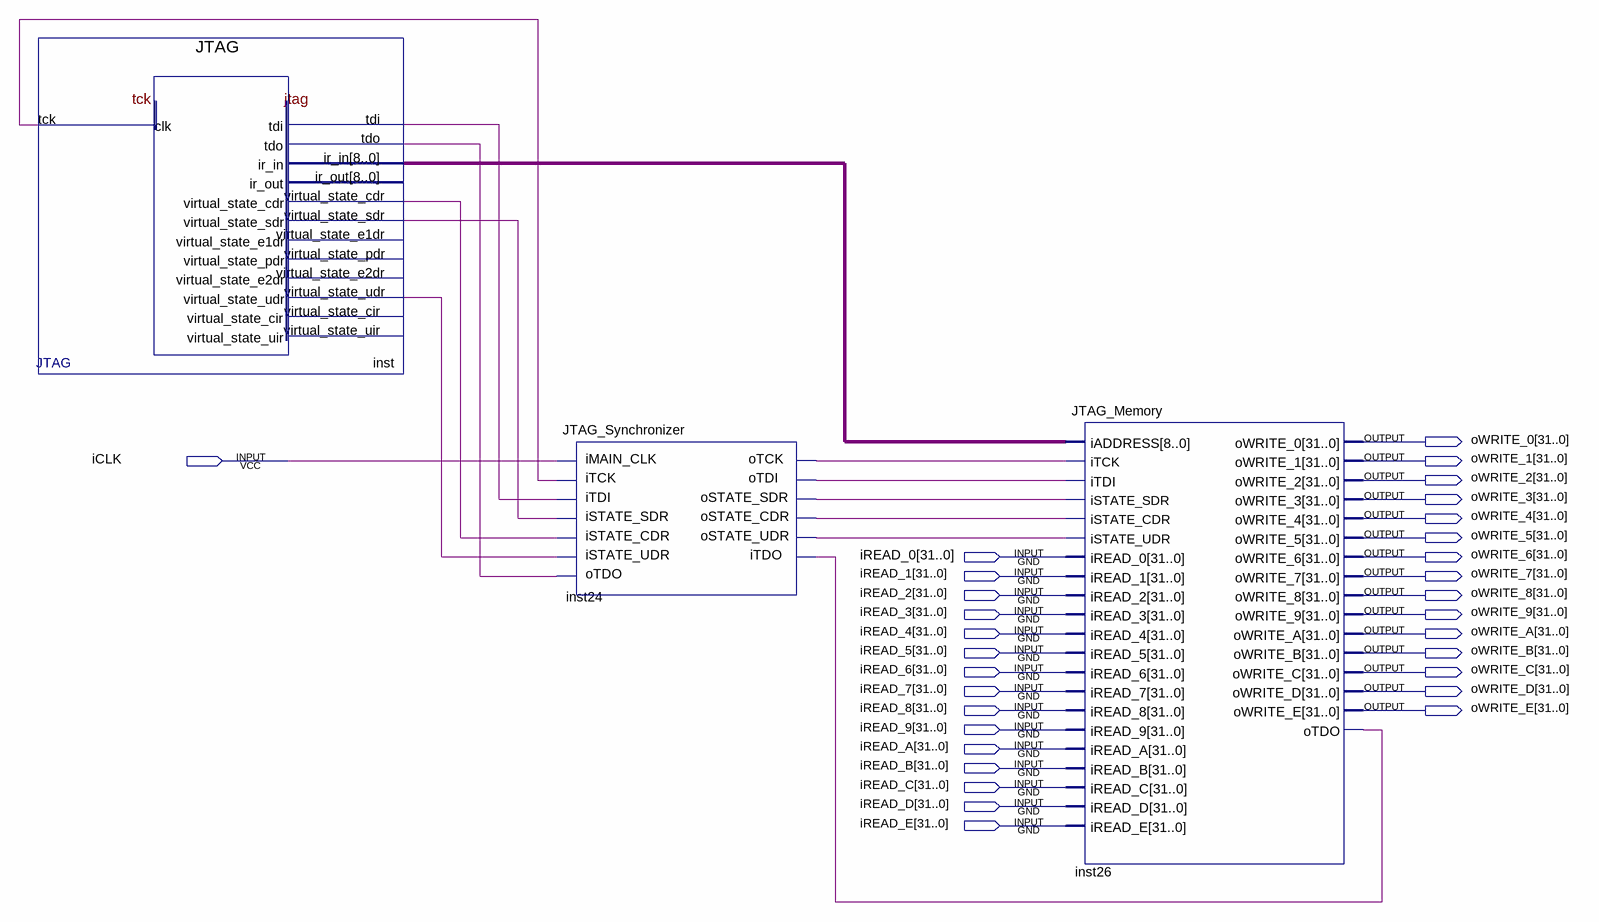
[diagram p0: schematic sheet]
// Quartus schematic JTAG_Interface.bdf as structural Verilog: 3 symbols, 31 pins
module JTAG_Interface (
  input  iCLK,
  input  [31:0] iREAD_0,
  input  [31:0] iREAD_1,
  input  [31:0] iREAD_2,
  input  [31:0] iREAD_3,
  input  [31:0] iREAD_4,
  input  [31:0] iREAD_5,
  input  [31:0] iREAD_6,
  input  [31:0] iREAD_7,
  input  [31:0] iREAD_8,
  input  [31:0] iREAD_9,
  input  [31:0] iREAD_A,
  input  [31:0] iREAD_B,
  input  [31:0] iREAD_C,
  input  [31:0] iREAD_D,
  input  [31:0] iREAD_E,
  output [31:0] oWRITE_0,
  output [31:0] oWRITE_1,
  output [31:0] oWRITE_2,
  output [31:0] oWRITE_3,
  output [31:0] oWRITE_4,
  output [31:0] oWRITE_5,
  output [31:0] oWRITE_6,
  output [31:0] oWRITE_7,
  output [31:0] oWRITE_8,
  output [31:0] oWRITE_9,
  output [31:0] oWRITE_A,
  output [31:0] oWRITE_B,
  output [31:0] oWRITE_C,
  output [31:0] oWRITE_D,
  output [31:0] oWRITE_E
);

  wire inst24_ostate_cdr, inst24_ostate_sdr, inst24_ostate_udr, inst24_otck, inst24_otdi, inst24_otdo,
       inst26_otdo, inst_tck, inst_tdi, inst_virtual_state_cdr, inst_virtual_state_sdr,
       inst_virtual_state_udr;
  wire [8:0] inst_ir_in;

  JTAG inst (
    .tdo(inst24_otdo), .tdi(inst_tdi), .ir_in(inst_ir_in), .virtual_state_cdr(inst_virtual_state_cdr),
    .virtual_state_sdr(inst_virtual_state_sdr), .virtual_state_udr(inst_virtual_state_udr), .tck(inst_tck));  // open: ir_out, virtual_state_e1dr, virtual_state_pdr, virtual_state_e2dr, virtual_state_cir, virtual_state_uir
  JTAG_Synchronizer inst24 (
    .iMAIN_CLK(iCLK), .iTCK(inst_tck), .iTDI(inst_tdi), .iSTATE_SDR(inst_virtual_state_sdr),
    .iSTATE_CDR(inst_virtual_state_cdr), .iSTATE_UDR(inst_virtual_state_udr), .iTDO(inst26_otdo),
    .oTCK(inst24_otck), .oTDI(inst24_otdi), .oSTATE_SDR(inst24_ostate_sdr), .oSTATE_CDR(inst24_ostate_cdr),
    .oSTATE_UDR(inst24_ostate_udr), .oTDO(inst24_otdo));
  JTAG_Memory inst26 (
    .iADDRESS(inst_ir_in), .iTCK(inst24_otck), .iTDI(inst24_otdi), .iSTATE_SDR(inst24_ostate_sdr),
    .iSTATE_CDR(inst24_ostate_cdr), .iSTATE_UDR(inst24_ostate_udr), .iREAD_0(iREAD_0), .iREAD_1(iREAD_1),
    .iREAD_2(iREAD_2), .iREAD_3(iREAD_3), .iREAD_4(iREAD_4), .iREAD_5(iREAD_5), .iREAD_6(iREAD_6),
    .iREAD_7(iREAD_7), .iREAD_8(iREAD_8), .iREAD_9(iREAD_9), .iREAD_A(iREAD_A), .iREAD_B(iREAD_B),
    .iREAD_C(iREAD_C), .iREAD_D(iREAD_D), .iREAD_E(iREAD_E), .oWRITE_0(oWRITE_0), .oWRITE_1(oWRITE_1),
    .oWRITE_2(oWRITE_2), .oWRITE_3(oWRITE_3), .oWRITE_4(oWRITE_4), .oWRITE_5(oWRITE_5), .oWRITE_6(oWRITE_6),
    .oWRITE_7(oWRITE_7), .oWRITE_8(oWRITE_8), .oWRITE_9(oWRITE_9), .oWRITE_A(oWRITE_A), .oWRITE_B(oWRITE_B),
    .oWRITE_C(oWRITE_C), .oWRITE_D(oWRITE_D), .oWRITE_E(oWRITE_E), .oTDO(inst26_otdo));
endmodule
